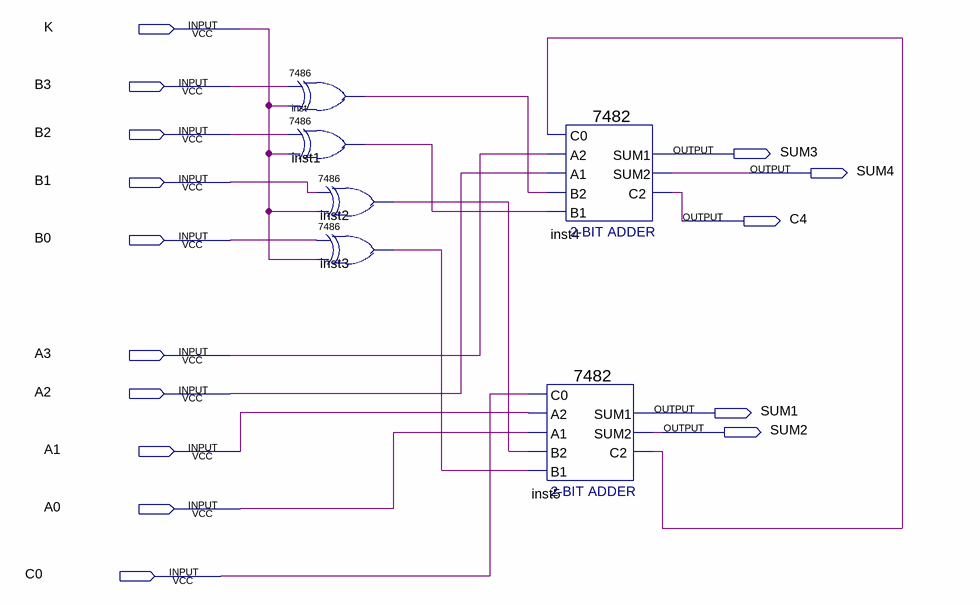
[diagram p0: schematic sheet]
// Quartus schematic simple.bdf as structural Verilog: 6 symbols, 15 pins
module simple (
  input  K,
  input  B3,
  input  B2,
  input  B1,
  input  B0,
  input  A3,
  input  A2,
  input  A1,
  input  A0,
  input  C0,
  output SUM3,
  output SUM4,
  output C4,
  output SUM1,
  output SUM2
);

  wire inst1_1, inst2_1, inst3_1, inst5_c2, inst_1;

  \7486  inst (.\2 (B3), .\3 (K), .\1 (inst_1));
  \7486  inst1 (.\2 (B2), .\3 (K), .\1 (inst1_1));
  \7486  inst2 (.\2 (B1), .\3 (K), .\1 (inst2_1));
  \7486  inst3 (.\2 (B0), .\3 (K), .\1 (inst3_1));
  \7482  inst5 (.A2(A1), .B2(inst2_1), .B1(inst3_1), .C0(C0), .A1(A0), .C2(inst5_c2), .SUM1(SUM1), .SUM2(SUM2));
  \7482  inst4 (.A2(A3), .B2(inst_1), .B1(inst1_1), .C0(inst5_c2), .A1(A2), .C2(C4), .SUM1(SUM3), .SUM2(SUM4));
endmodule
